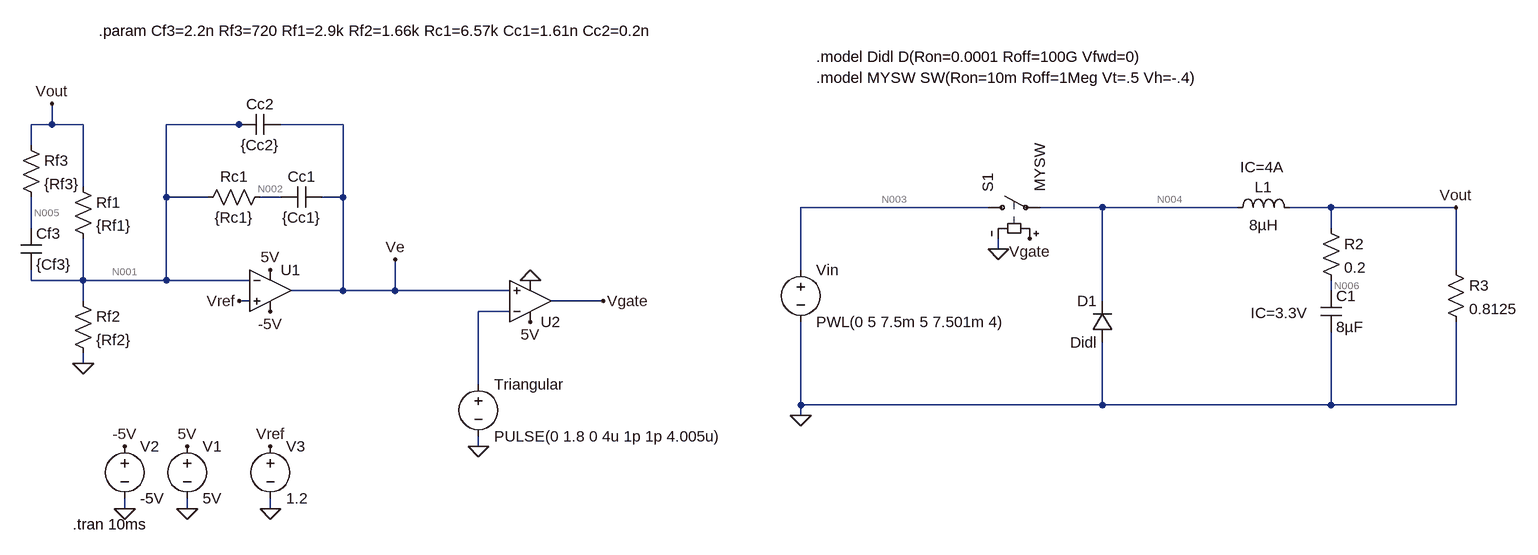
[diagram p0: schematic Q10_type_III_A.asc]
Q10_type_III_A.asc, the LTspice schematic file:
Version 4
SHEET 1 2496 680
WIRE -192 -304 -192 -336
WIRE -192 -304 -224 -304
WIRE -144 -304 -192 -304
WIRE 96 -304 -16 -304
WIRE 112 -304 96 -304
WIRE 256 -304 160 -304
WIRE -224 -272 -224 -304
WIRE -144 -208 -144 -304
WIRE -16 -192 -16 -304
WIRE 48 -192 -16 -192
WIRE 160 -192 128 -192
WIRE 256 -192 256 -304
WIRE 256 -192 224 -192
WIRE 1248 -176 960 -176
WIRE 1424 -176 1328 -176
WIRE 1632 -176 1424 -176
WIRE 1776 -176 1712 -176
WIRE 1968 -176 1776 -176
WIRE -224 -144 -224 -192
WIRE 1776 -144 1776 -176
WIRE 1264 -112 1264 -128
WIRE 960 -80 960 -176
WIRE 1968 -80 1968 -176
WIRE -224 -64 -224 -80
WIRE -144 -64 -144 -128
WIRE -144 -64 -224 -64
WIRE -16 -64 -16 -192
WIRE -16 -64 -144 -64
WIRE 112 -64 -16 -64
WIRE 256 -48 256 -192
WIRE 256 -48 176 -48
WIRE 336 -48 336 -96
WIRE 336 -48 256 -48
WIRE 512 -48 336 -48
WIRE 1776 -48 1776 -64
WIRE -144 -32 -144 -64
WIRE 112 -32 96 -32
WIRE 656 -32 576 -32
WIRE 1424 -32 1424 -176
WIRE 512 -16 464 -16
WIRE -144 64 -144 48
WIRE 464 96 464 -16
WIRE 960 128 960 0
WIRE 1424 128 1424 32
WIRE 1424 128 960 128
WIRE 1776 128 1776 16
WIRE 1776 128 1424 128
WIRE 1968 128 1968 0
WIRE 1968 128 1776 128
WIRE 960 144 960 128
WIRE 464 192 464 176
WIRE -80 288 -80 272
WIRE 16 288 16 272
WIRE 144 288 144 272
FLAG 16 288 0
FLAG -80 288 0
FLAG 16 192 5V
FLAG -80 192 -5V
FLAG 144 -80 5V
FLAG 144 288 0
FLAG 144 192 Vref
FLAG 96 -32 Vref
FLAG -144 64 0
FLAG -192 -336 Vout
FLAG 336 -96 Ve
FLAG 464 192 0
FLAG 544 0 5V
FLAG 656 -32 Vgate
FLAG 960 144 0
FLAG 1264 -112 0
FLAG 1312 -128 Vgate
FLAG 1968 -176 Vout
FLAG 144 -16 -5V
FLAG 544 -64 0
SYMBOL voltage 16 176 R0
WINDOW 123 0 0 Left 0
WINDOW 39 0 0 Left 0
SYMATTR InstName V1
SYMATTR Value 5V
SYMBOL voltage -80 176 R0
WINDOW 123 0 0 Left 0
WINDOW 39 0 0 Left 0
SYMATTR InstName V2
SYMATTR Value -5V
SYMBOL OpAmps\\UniversalOpAmp2 144 -48 R0
SYMATTR InstName U1
SYMBOL res 144 -208 R90
WINDOW 0 0 56 VBottom 2
WINDOW 3 32 56 VTop 2
SYMATTR InstName Rc1
SYMATTR Value {Rc1}
SYMBOL cap 224 -208 R90
WINDOW 0 0 32 VBottom 2
WINDOW 3 32 32 VTop 2
SYMATTR InstName Cc1
SYMATTR Value {Cc1}
SYMBOL cap 160 -320 R90
WINDOW 0 0 32 VBottom 2
WINDOW 3 32 32 VTop 2
SYMATTR InstName Cc2
SYMATTR Value {Cc2}
SYMBOL voltage 144 176 R0
WINDOW 123 0 0 Left 0
WINDOW 39 0 0 Left 0
SYMATTR InstName V3
SYMATTR Value 1.2
SYMBOL res -160 -48 R0
SYMATTR InstName Rf2
SYMATTR Value {Rf2}
SYMBOL cap -240 -144 R0
SYMATTR InstName Cf3
SYMATTR Value {Cf3}
SYMBOL res -240 -288 R0
SYMATTR InstName Rf3
SYMATTR Value {Rf3}
SYMBOL res -160 -224 R0
SYMATTR InstName Rf1
SYMATTR Value {Rf1}
SYMBOL voltage 464 80 R0
WINDOW 123 0 0 Left 0
WINDOW 39 0 0 Left 0
SYMATTR InstName Triangular
SYMATTR Value PULSE(0 1.8 0 4u 1p 1p 4.005u)
SYMBOL OpAmps\\UniversalOpAmp2 544 -32 M180
SYMATTR InstName U2
SYMATTR Value2 Avol=1Meg GBW=50Meg Slew=50Meg
SYMBOL voltage 960 -96 R0
WINDOW 123 0 0 Left 0
WINDOW 39 0 0 Left 0
SYMATTR InstName Vin
SYMATTR Value PWL(0 5 7.5m 5 7.501m 4)
SYMBOL sw 1232 -176 R270
SYMATTR InstName S1
SYMATTR Value MYSW
SYMBOL diode 1440 32 R180
WINDOW 0 24 64 Left 2
WINDOW 3 24 0 Left 2
SYMATTR InstName D1
SYMATTR Value Didl
SYMBOL ind 1616 -160 R270
WINDOW 0 32 56 VTop 2
WINDOW 3 5 56 VBottom 2
WINDOW 39 63 54 VTop 2
SYMATTR InstName L1
SYMATTR Value 8µH
SYMATTR SpiceLine IC=4A
SYMBOL res 1760 -160 R0
SYMATTR InstName R2
SYMATTR Value 0.2
SYMBOL cap 1760 -48 R0
WINDOW 39 -108 34 Left 2
SYMATTR SpiceLine IC=3.3V
SYMATTR InstName C1
SYMATTR Value 8µF
SYMBOL res 1952 -96 R0
SYMATTR InstName R3
SYMATTR Value 0.8125
TEXT -120 -448 Left 2 !.param Cf3=2.2n Rf3=720 Rf1=2.9k Rf2=1.66k Rc1=6.57k Cc1=1.61n Cc2=0.2n
TEXT 984 -376 Left 2 !.model MYSW SW(Ron=10m Roff=1Meg Vt=.5 Vh=-.4)
TEXT 984 -408 Left 2 !.model Didl D(Ron=0.0001 Roff=100G Vfwd=0)
TEXT -160 312 Left 2 !.tran 10ms

The netlist it stands for:
* Q10_type_III_A.asc
V1 5V 0 5V
V2 -5V 0 -5V
XU1 Vref N001 5V -5V Ve level2 Avol=1Meg GBW=10Meg Slew=10Meg Ilimit=25m Rail=0 Vos=0 En=0 Enk=0 In=0 Ink=0 Rin=500Meg  ; pins In+ In- V+ V- OUT
Rc1 N002 N001 {Rc1}
Cc1 Ve N002 {Cc1}
Cc2 Ve N001 {Cc2}
V3 Vref 0 1.2
Rf2 N001 0 {Rf2}
Cf3 N005 N001 {Cf3}
Rf3 Vout N005 {Rf3}
Rf1 Vout N001 {Rf1}
V§Triangular N007 0 PULSE(0 1.8 0 4u 1p 1p 4.005u)
XU2 Ve N007 5V 0 Vgate level2 Avol=1Meg GBW=50Meg Slew=50Meg Ilimit=25m Rail=0 Vos=0 En=0 Enk=0 In=0 Ink=0 Rin=500Meg  ; pins In+ In- V+ V- OUT
Vin N003 0 PWL(0 5 7.5m 5 7.501m 4)
S1 N003 N004 Vgate 0 MYSW
D1 0 N004 Didl
L1 N004 Vout 8µH IC=4A
R2 Vout N006 0.2
C1 N006 0 8µF IC=3.3V
R3 Vout 0 0.8125
.model D D
.lib standard.dio
.param Cf3=2.2n Rf3=720 Rf1=2.9k Rf2=1.66k Rc1=6.57k Cc1=1.61n Cc2=0.2n
.model MYSW SW(Ron=10m Roff=1Meg Vt=.5 Vh=-.4)
.model Didl D(Ron=0.0001 Roff=100G Vfwd=0)
.tran 10ms
.lib UniversalOpAmp2.lib
.backanno
.end

* Results of the author's LTspice run, read from the files saved beside the schematic
* Operating Point, zero values left out:
*   V(5v) = 5 V
*   V(-5v) = -5 V
*   V(ve) = 5 V
*   V(n001) = 1.198 V
*   V(vref) = 1.2 V
*   V(n002) = 1.198 V
*   V(n005) = 3.29 V
*   V(vout) = 3.29 V
*   V(vgate) = 5 V
*   V(n003) = 5 V
*   V(n004) = 4.96 V
*   V(n006) = 3.3 V
*   I(C1) = -49.91 mA
*   I(D1) = -49.6 pA
*   I(L1) = 4 A
*   I(Rf2) = 721.5 µA
*   I(Rf1) = 721.5 µA
*   I(R2) = -49.91 mA
*   I(R3) = 4.049 A
*   I(S1) = -4 A
*   I(V1) = -1.801 µA
*   I(V2) = 1.406 µA
*   I(V3) = -2.4 nA
*   I(Triangular) = 5 nA
*   I(Vin) = -4 A
*   Ix(u1:1) = 2.4 nA
*   Ix(u1:2) = 2.395 nA
*   Ix(u1:3) = 1.341 µA
*   Ix(u1:4) = -1.406 µA
*   Ix(u1:5) = -5 nA
*   Ix(u2:1) = 5 nA
*   Ix(u2:2) = -5 nA
*   Ix(u2:3) = 460.2 nA
*   Ix(u2:4) = -610.5 nA